# EasyEDA Pro project EasyEda.epro

# Schematic drv8833
Board Name: drv8833; Create Date: 2026-02-26; Page Name: P1; Project Name: motor driver; Schematic Name: drv8833; Update Date: 2026-03-20; Company: EasyEDA.com; Page Size: A4; Version: V1.0
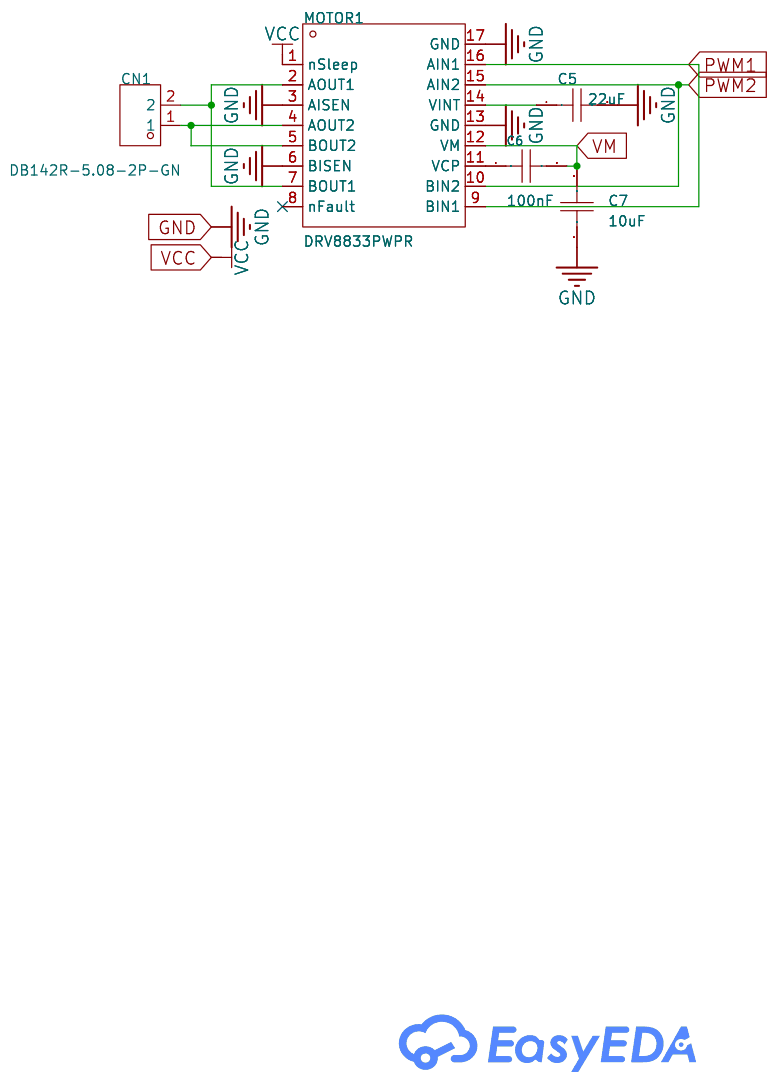
[diagram p0: schematic sheet]

## Parts
C5  22uF  [C0805]
C6  100nF  [C0402]
C7  10uF  [C0805]
CN1  DB142R-5.08-2P-GN  [CONN-TH_2P-P5.08_DIBO_DB142R-5.08-2P]
MOTOR1  DRV8833PWPR  [TSSOP-16_L5.0-W4.4-P0.65-LS6.4-BL-EP]

## Library data of the parts
C5 = CL21A226MAQNNNE: Capacitance:22uF Tolerance:±20% Tolerance:±20% Voltage Rating:25V Temperature Coefficient:X5R; LCSC Part Name: 22uF ±20% 25V; Supplier Part: C45783; Manufacturer: SAMSUNG(三星); Supplier Footprint: 0805; JLCPCB Part Class: Basic Part; Datasheet: https://item.szlcsc.com/datasheet/CL21A226MAQNNNE/46786.html; Supplier: LCSC; Tolerance: ±20%; Voltage Rating: 25V; Temperature Coefficient: X5R
C6 = CL05B104KO5NNNC: Capacitance:100nF Tolerance:±10% Tolerance:±10% Voltage Rating:16V Temperature Coefficient:X7R; LCSC Part Name: 100nF ±10% 16V; Supplier Part: C1525; Manufacturer: SAMSUNG(三星); Supplier Footprint: 0402; JLCPCB Part Class: Basic Part; Datasheet: https://item.szlcsc.com/datasheet/CL05B104KO5NNNC/1877.html; Supplier: LCSC; Tolerance: ±10%; Voltage Rating: 16V; Temperature Coefficient: X7R
C7 = CL21A106KAYNNNE_C15850: Capacitance:10uF Tolerance:±10% Tolerance:±10% Voltage Rating:25V Temperature Coefficient:X5R; LCSC Part Name: 10uF ±10% 25V; Supplier Part: C15850; Manufacturer: SAMSUNG(三星); Manufacturer Part: CL21A106KAYNNNE; Supplier Footprint: 0805; JLCPCB Part Class: Basic Part; Datasheet: https://item.szlcsc.com/datasheet/CL21A106KAYNNNE/16532.html; Supplier: LCSC; Tolerance: ±10%; Voltage Rating: 25V; Temperature Coefficient: X5R
CN1 = DB142R-5.08-2P-GN: Number of Positions or Pins:1x2P Pitch:5.08mm Color:Green Mounting Type:- Number of Pins:2P Number of PINs Per Row:2 Number of Rows:1 Current Rating:10A Voltage Rating (Max):300V Wire Gauge - AWG:14~24 Wire Gauge - mm2:1.5 Operating Temperature:-40℃~+105℃; LCSC Part Name: 1x2P 5.08mm 每排P数:2 排数:1; Supplier Part: C2898709; Manufacturer: DORABO(地博电气); Supplier Footprint: 弯插,P=5.08mm; Datasheet: https://item.szlcsc.com/datasheet/DB142R-5.08-2P-GN/3146288.html; Supplier: LCSC; Number of Positions or Pins: 1x2P; Pitch: 5.08mm; Color: Green; Number of Pins: 2P; Number of PINs Per Row: 2; Number of Rows: 1; Current Rating: 10A; Voltage Rating (Max): 300V; Wire Gauge - AWG: 14~24; Wire Gauge - mm2: 1.5; Operating Temperature: -40℃~+105℃
MOTOR1 = DRV8833PWPR: Technology:Yes Operating Temperature:-40℃~+85℃ Operating Temperature:-40℃~+85℃; LCSC Part Name: 1.5A 有刷直流电机驱动芯片 10.8V; Supplier Part: C50506; Manufacturer: TI(德州仪器); Supplier Footprint: TSSOP-16-EP; JLCPCB Part Class: Extended Part; Datasheet: https://www.ti.com/cn/lit/gpn/drv8833; Supplier: LCSC; Technology: Yes; Operating Temperature: -40℃~+85℃

## Nets
GND: C5.2 C7.1 MOTOR1.3(AISEN) MOTOR1.6(BISEN) MOTOR1.13(GND) MOTOR1.17(GND)
VCC: MOTOR1.1(nSleep)
PWM1: MOTOR1.9(BIN1) MOTOR1.16(AIN1)
PWM2: MOTOR1.10(BIN2) MOTOR1.15(AIN2)
VM: C6.2 C7.2 MOTOR1.12(VM)
$1N433: C5.1 MOTOR1.14(VINT)
$1N443: C6.1 MOTOR1.11(VCP)
$1N451: CN1.2 MOTOR1.2(AOUT1) MOTOR1.7(BOUT1)
$1N910: CN1.1 MOTOR1.4(AOUT2) MOTOR1.5(BOUT2)

Not connected (* = marked no-connect by the designer): MOTOR1 8(nFault)*

# Schematic MT6701
Board Name: MT6701; Create Date: 2026-02-26; Page Name: P1; Project Name: motor driver; Schematic Name: MT6701; Update Date: 2026-03-17; Company: EasyEDA.com; Page Size: A4; Version: V1.0
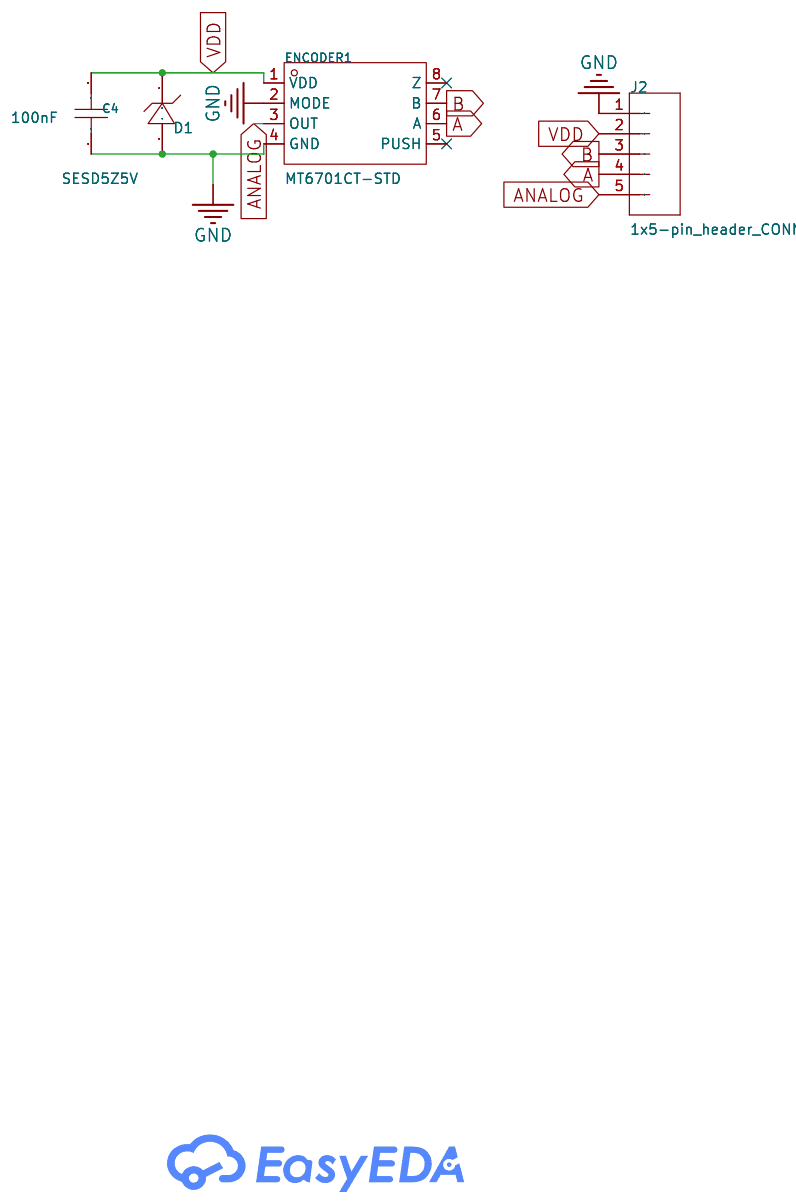
[diagram p1: schematic sheet]

## Parts
C4  100nF  [C0402]
D1  SESD5Z5V  [SOD-523_L1.2-W0.8-LS1.6-RD]
ENCODER1  MT6701CT-STD  [SOP-8_L4.9-W3.9-P1.27-LS6.0-BL]
J2  1x5-pin_header_CONN_05_NO_SILK  [1X05_NO_SILK-CUSTOM]

## Library data of the parts
C4 = CC0402KRX7R7BB104: Capacitance: Tolerance:±10% Tolerance:±10% Voltage Rated: Temperature Coefficient:; LCSC Part Name: 100nF ±10% 16V; Supplier Part: C60474; Manufacturer: YAGEO(国巨); Supplier Footprint: 0402; JLCPCB Part Class: Extended Part; Datasheet: https://atta.szlcsc.com/upload/public/pdf/source/20211223/9278FD768280B81DDBEF48FA36411A03.pdf; Supplier: LCSC; Tolerance: ±10%
D1 = SESD5Z5V: Reverse Stand-Off Voltage (Vrwm):5V Clamping Voltage:6V Peak Pulse Power Dissipation (Ppp):200W@8/20us Voltage - Breakdown:7.1V Reverse Leakage Current (Ir):1uA Operating Temperature:-40℃~+125℃ Operating Temperature:-40℃~+125℃ level of protection:IEC 6100; LCSC Part Name: TVS 5V截止; Supplier Part: C19631222; Manufacturer: SINO-IC(光宇睿芯); Supplier Footprint: SOD-523; JLCPCB Part Class: Extended Part; Datasheet: https://item.szlcsc.com/datasheet/SESD5Z5V/20924295.html; Supplier: LCSC; Reverse Stand-Off Voltage (Vrwm): 5V; Clamping Voltage: 6V; Peak Pulse Power Dissipation (Ppp): 200W@8/20us; Voltage - Breakdown: 7.1V; Reverse Leakage Current (Ir): 1uA; Operating Temperature: -40℃~+125℃; level of protection: IEC 61000-4-4；IEC 61000-4-2; Type: TVS; Junction Capacitance: 30pF
ENCODER1 = MT6701CT-STD: LCSC Part Name: 霍尔在线编程角度位置传感器; Supplier Part: C2856764; Manufacturer: MagnTek(麦歌恩); Supplier Footprint: SOP-8; Datasheet: https://item.szlcsc.com/datasheet/MT6701CT-STD/3056853.html; Supplier: LCSC
J2 = 1x5-pin_header_CONN_05_NO_SILK

## Nets
GND: C4.1 D1.2(A) ENCODER1.2(MODE) ENCODER1.4(GND) J2.1
VDD: C4.2 D1.1(C) ENCODER1.1(VDD) J2.2
A: ENCODER1.6(A) J2.4
ANALOG: ENCODER1.3(OUT) J2.5
B: ENCODER1.7(B) J2.3

Not connected (* = marked no-connect by the designer): ENCODER1 5(PUSH)* 8(Z)*

# Schematic Schematic1

## Sheets
1 P1: Board Name: Board1; Create Date: 2026-02-24; Page Name: P1; Project Name: motor driver; Schematic Name: Schematic1; Update Date: 2026-03-19; Company: EasyEDA.com; Page Size: A4; Version: V1.0
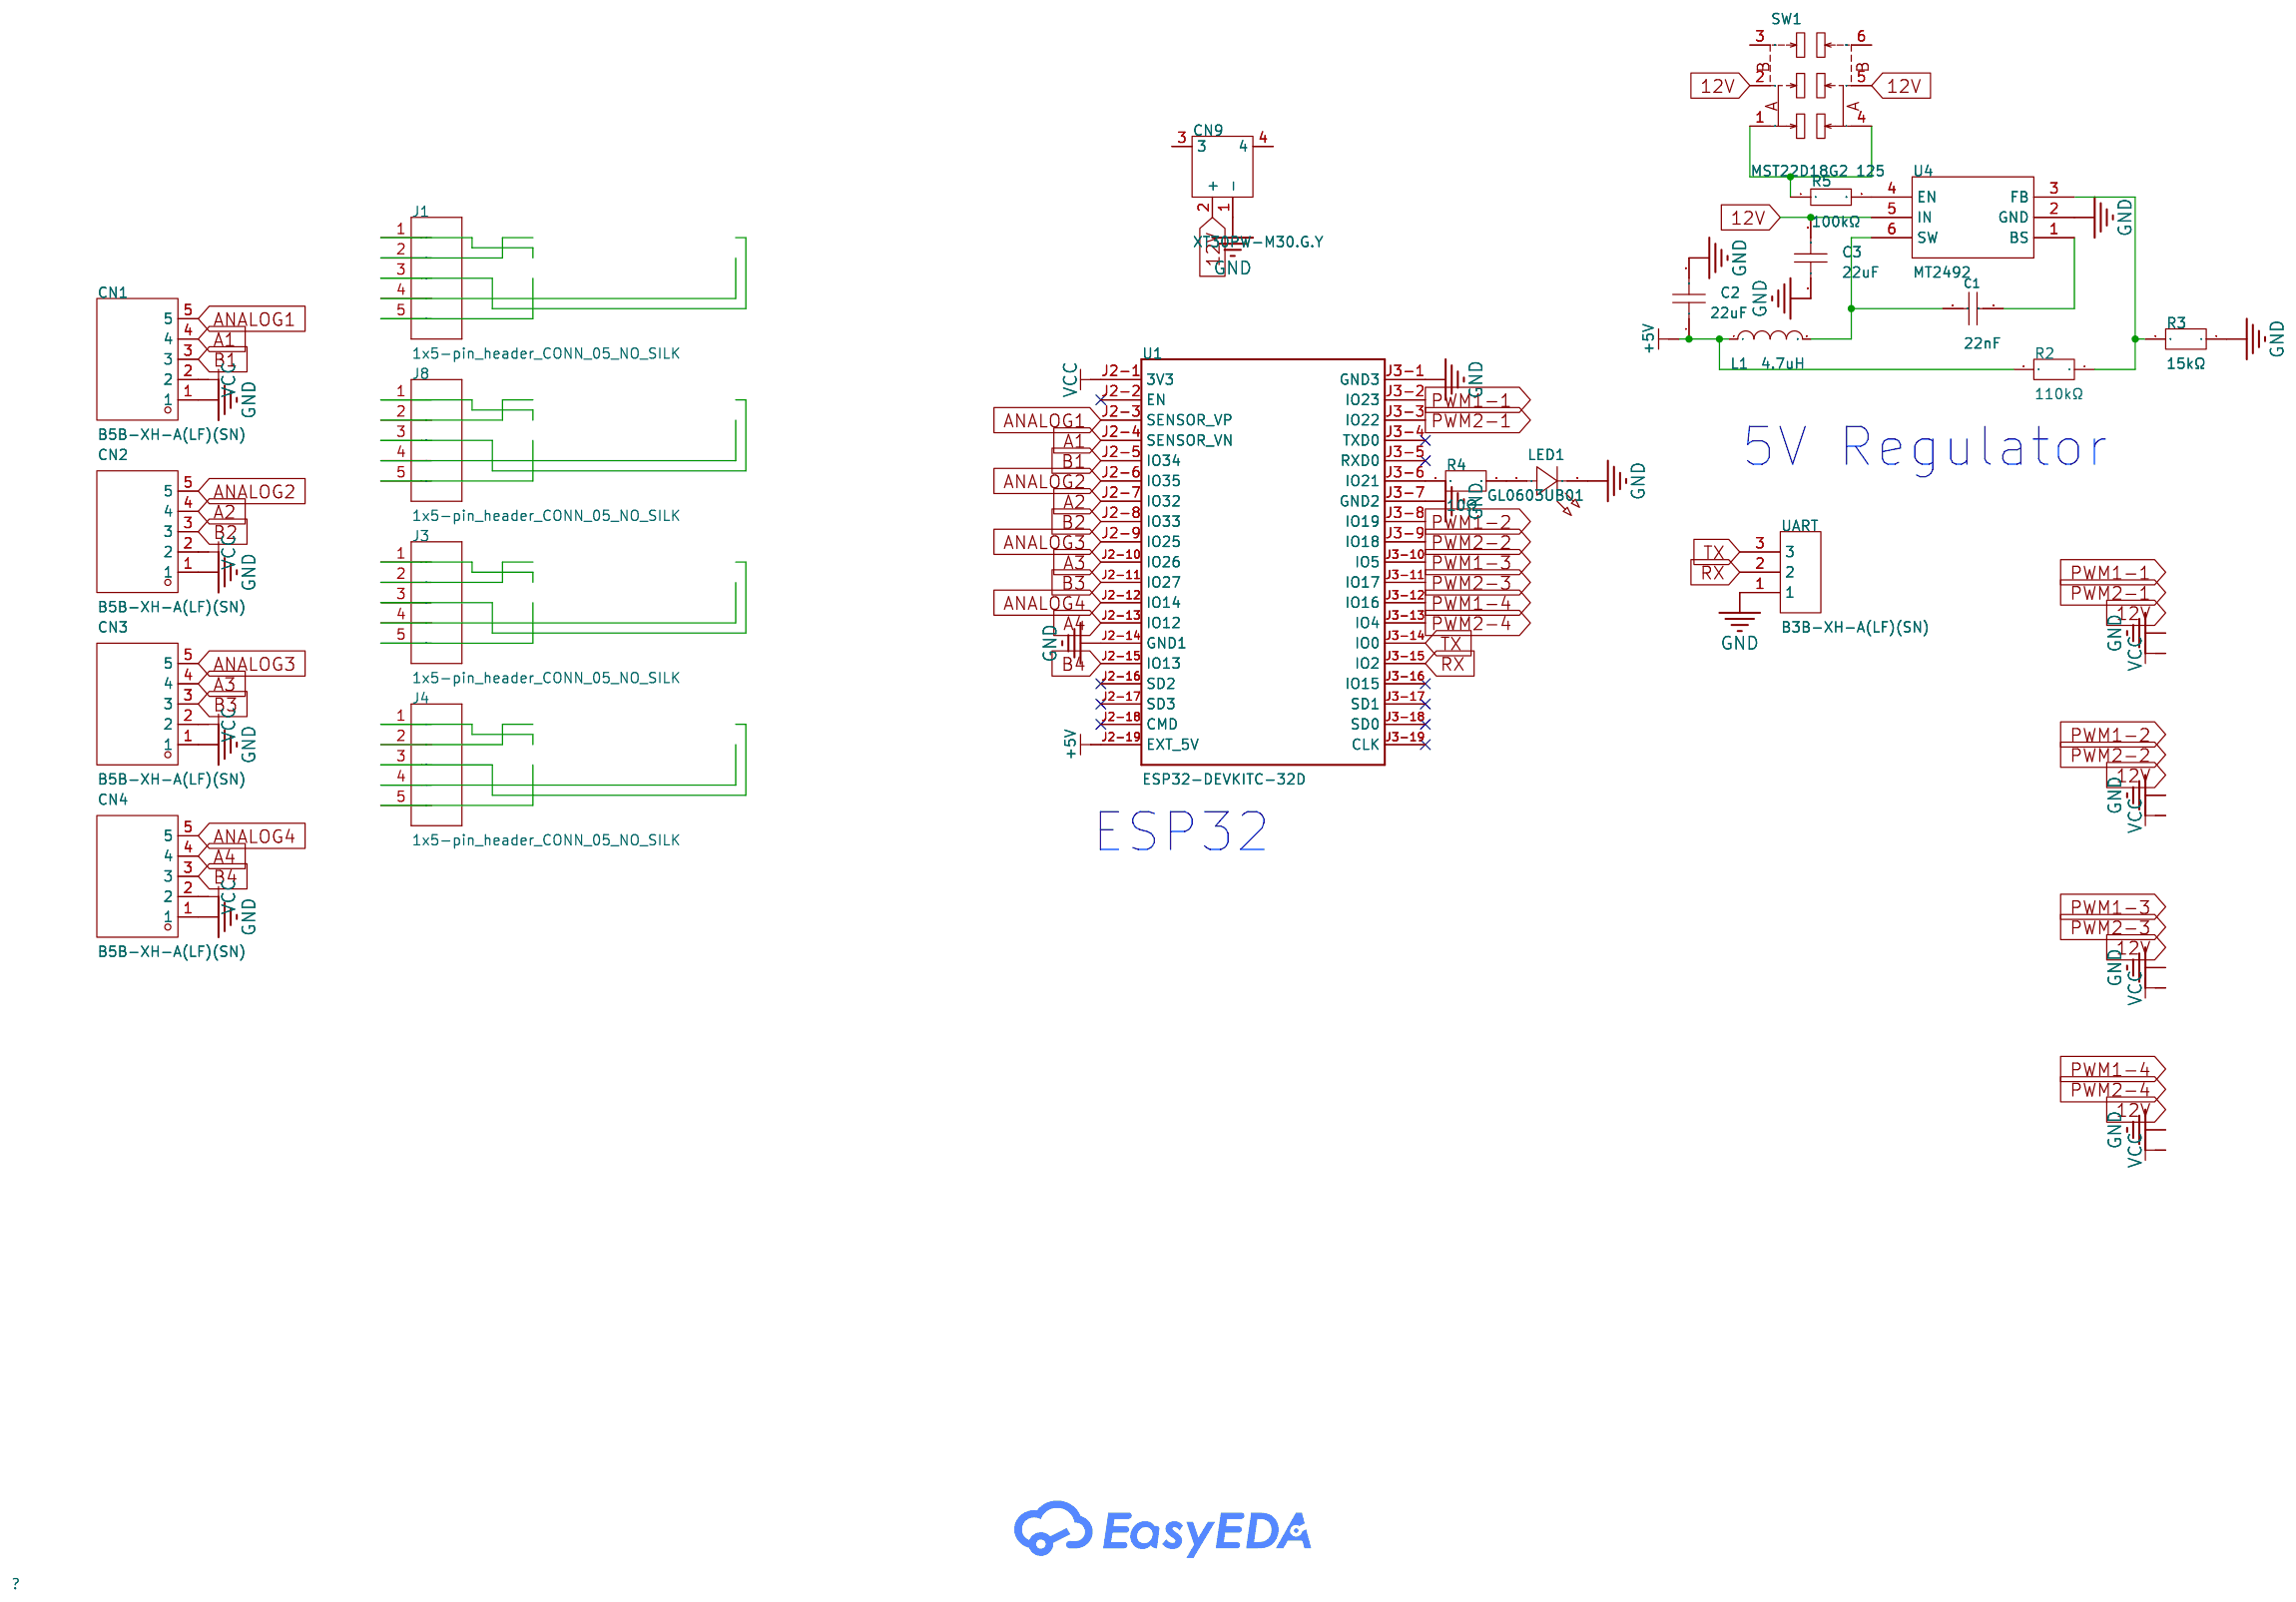
[diagram p2: P1]
2 P2: Create Date: 2026-02-25; Page Name: P2; Update Date: 2026-02-24
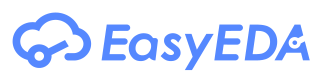
[diagram p3: P2]

## Parts
C1  22nF  [C0603]
C2  22uF  [C0805]
C3  22uF  [C0805]
CN1  B5B-XH-A(LF)(SN)  [CONN-TH_B5B-XH-A-LF-SN]
CN2  B5B-XH-A(LF)(SN)  [CONN-TH_B5B-XH-A-LF-SN]
CN3  B5B-XH-A(LF)(SN)  [CONN-TH_B5B-XH-A-LF-SN]
CN4  B5B-XH-A(LF)(SN)  [CONN-TH_B5B-XH-A-LF-SN]
CN9  XT30PW-M30.G.Y  [CONN-TH_XT30PW-M]
ENCODE1  -
ENCODE2  -
ENCODE3  -
ENCODE4  -
J1  1x5-pin_header_CONN_05_NO_SILK  [1X05_NO_SILK-CUSTOM]
J3  1x5-pin_header_CONN_05_NO_SILK  [1X05_NO_SILK-CUSTOM]
J4  1x5-pin_header_CONN_05_NO_SILK  [1X05_NO_SILK-CUSTOM]
J8  1x5-pin_header_CONN_05_NO_SILK  [1X05_NO_SILK-CUSTOM]
L1  4.7uH  [IND-SMD_L3.0-W3.0-1]
LED1  GL0603UB01  [LED0603-RD_BLUE]
MOTORDRIVER1  -
MOTORDRIVER2  -
MOTORDRIVER3  -
MOTORDRIVER4  -
R2  110kΩ  [R0603]
R3  15kΩ  [R0603]
R4  10Ω  [R1206]
R5  100kΩ  [R0402]
SW1  MST22D18G2 125  [SW-SMD_MST22D18G2]
U1  ESP32-DEVKITC-32D  [MODULE_ESP32-DEVKITC-32D]
U4  MT2492  [SOT-23-6_L2.9-W1.6-P0.95-LS2.8-BL_3]
UART  B3B-XH-A(LF)(SN)  [CONN-TH_3P-P2.50_A2501WV2-3P]

## Library data of the parts
C1 = CL10B223KB8NNNC: Capacitance:22nF Tolerance:±10% Tolerance:±10% Voltage Rating:50V Temperature Coefficient:X7R; LCSC Part Name: 22nF ±10% 50V; Supplier Part: C21122; Manufacturer: SAMSUNG(三星); Supplier Footprint: 0603; Datasheet: https://item.szlcsc.com/datasheet/CL10B223KB8NNNC/21834.html; Supplier: LCSC; Tolerance: ±10%; Voltage Rating: 50V; Temperature Coefficient: X7R
C2 C3 = CL21A226MQQNNNE: Capacitance:22uF Tolerance:±20% Tolerance:±20% Voltage Rating:6.3V Temperature Coefficient:X5R; LCSC Part Name: 22uF ±20% 6.3V; Supplier Part: C5674; Manufacturer: SAMSUNG(三星); Supplier Footprint: 0805; JLCPCB Part Class: Extended Part; Datasheet: https://item.szlcsc.com/datasheet/CL21A226MQQNNNE/6133.html; Supplier: LCSC; Tolerance: ±20%; Voltage Rating: 6.3V; Temperature Coefficient: X5R
CN1-CN4 = B5B-XH-A(LF)(SN): Pins Structure:1x5P Pitch:2.5mm Mounting Type:Through Hole Reference Series:XH Number of Pins:5P Number of Rows:1 Number of PINs Per Row:5 Row Spacing:- Current Rating:3A Contact Material:Brass Contact Plating:Tin Operating Temperature:-25℃~+85℃ Operating; LCSC Part Name: 1x5P 间距:2.5mm 直插 系列:XH; Supplier Part: C157991; Manufacturer: JST; Supplier Footprint: 插件,P=2.5mm; JLCPCB Part Class: Extended Part; Datasheet: https://item.szlcsc.com/datasheet/B5B-XH-A(LF)(SN)/169339.html; Supplier: LCSC; Pins Structure: 1x5P; Pitch: 2.5mm; Mounting Type: Through Hole; Reference Series: XH; Number of Pins: 5P; Number of Rows: 1; Number of PINs Per Row: 5; Current Rating: 3A; Contact Material: Brass; Contact Plating: Tin; Operating Temperature: -25℃~+85℃; Voltage Rating: 250V; Plastic Material: PA66; Flame Retardant Rating: UL94V-0; Supplementary Features: K Pin; Color: White; Z-Height of the Board: 7mm; X-Length of Bottom Edge on Board (Spacing Line): 14.9mm; Y-Width of Bottom Edge on Board: 5.75mm
CN9 = XT30PW-M30.G.Y: Rated current:15A Rated voltage: Connector type:Model aircraft plug Wire gauge: contact resistance: Size/Specification: interface form:Male; LCSC Part Name: AMASS(艾迈斯)航模插头 卧式弯脚 XT30PW-M公头; Supplier Part: C431092; Manufacturer: AMASS(艾迈斯); Datasheet: https://item.szlcsc.com/datasheet/XT30PW-M30.G.Y/426930.html; Supplier: LCSC; Rated current: 15A; Connector type: Model aircraft plug; interface form: Male
J1 J3 J4 J8 = 1x5-pin_header_CONN_05_NO_SILK
L1 = ANR3015T4R7M: Inductance:4.7uH Tolerance:±20% Tolerance:±20% Current Rating:1.3A Current - Saturation(Isat):1.4A Type:Magnetic Shielded Inductor; LCSC Part Name: 4.7uH ±20% 1.4A 3x3x1.5mm; Supplier Part: C7427089; Manufacturer: APV(爱普微); Supplier Footprint: SMD,3x3mm; JLCPCB Part Class: Extended Part; Datasheet: https://item.szlcsc.com/datasheet/ANR3015T4R7M/8418961.html; Supplier: LCSC; Tolerance: ±20%; Current Rating: 1.3A; Current - Saturation(Isat): 1.4A; Type: Magnetic Shielded Inductor
LED1 = GL0603UB01: Illumination Color:Blue Voltage - Forward(Vf):2.9V Voltage - Forward(Vf):2.9V Forward Current:20mA Wavelength - Dominant:460nm~469nm Wavelength - Dominant:460nm~469nm Diode Configuration:Discrete Diode Lens Color:Water Clear Luminous Intensity:72mcd Lumin; LCSC Part Name: 0603 蓝灯 高亮; Supplier Part: C51933294; Manufacturer: Guiguang light(桂光光电); Supplier Footprint: 0603; JLCPCB Part Class: Extended Part; Datasheet: https://item.szlcsc.com/datasheet/GL0603UB01/54645990.html; Supplier: LCSC; Illumination Color: Blue; Voltage - Forward(Vf): 2.9V; Forward Current: 20mA; Wavelength - Dominant: 460nm~469nm; Diode Configuration: Discrete Diode; Lens Color: Water Clear; Luminous Intensity: 72mcd; Viewing Angle: 120°; Mounting Style: Top-mount; Operating Temperature: -40℃~+85℃
R2 = FRC0603F1103TS: Type:Thick Film Resistor Resistance:110kΩ Tolerance:±1% Tolerance:±1% Power(Watts):100mW Voltage-Supply(Max):75V Temperature Coefficient:±100ppm/℃ Temperature Coefficient:±100ppm/℃ Operating Temperature:-55℃~+155℃ Operating Temperature:-55℃~+155℃; LCSC Part Name: 110kΩ ±1% 100mW 厚膜电阻; Supplier Part: C2906984; Manufacturer: FOJAN(富捷); Supplier Footprint: 0603; Supplier: LCSC; Type: Thick Film Resistor; Tolerance: ±1%; Power(Watts): 100mW; Voltage-Supply(Max): 75V; Temperature Coefficient: ±100ppm/℃; Operating Temperature: -55℃~+155℃
R3 = FRC0603F1502TS: Type:Thick Film Resistor Resistance:15kΩ Tolerance:±1% Tolerance:±1% Power(Watts):100mW Voltage-Supply(Max):75V Temperature Coefficient:±100ppm/℃ Temperature Coefficient:±100ppm/℃ Operating Temperature:-55℃~+155℃ Operating Temperature:-55℃~+155℃; LCSC Part Name: 15kΩ ±1% 100mW 厚膜电阻; Supplier Part: C2906995; Manufacturer: FOJAN(富捷); Supplier Footprint: 0603; JLCPCB Part Class: Extended Part; Supplier: LCSC; Type: Thick Film Resistor; Tolerance: ±1%; Power(Watts): 100mW; Voltage-Supply(Max): 75V; Temperature Coefficient: ±100ppm/℃; Operating Temperature: -55℃~+155℃
R4 = FRC1206F10R0TS: Type:Thick Film Resistor Resistance:10Ω Tolerance:±1% Tolerance:±1% Power(Watts):250mW Voltage-Supply(Max):200V Temperature Coefficient:±200ppm/℃ Temperature Coefficient:±200ppm/℃ Operating Temperature:-55℃~+155℃ Operating Temperature:-55℃~+155℃; LCSC Part Name: 10Ω ±1% 250mW 厚膜电阻; Supplier Part: C2907371; Manufacturer: FOJAN(富捷); Supplier Footprint: 1206; Supplier: LCSC; Type: Thick Film Resistor; Tolerance: ±1%; Power(Watts): 250mW; Voltage-Supply(Max): 200V; Temperature Coefficient: ±200ppm/℃; Operating Temperature: -55℃~+155℃
R5 = RC0402FR-07100KL: Type:Thick Film Resistor Resistance:100kΩ Tolerance:±1% Tolerance:±1% Power(Watts):62.5mW Voltage-Supply(Max):50V Temperature Coefficient:±100ppm/℃ Temperature Coefficient:±100ppm/℃ Operating Temperature:-55℃~+155℃ Operating Temperature:-55℃~+155℃; LCSC Part Name: 厚膜电阻 100kΩ ±1% 62.5mW; Supplier Part: C60491; Manufacturer: YAGEO(国巨); Supplier Footprint: 0402; JLCPCB Part Class: Extended Part; Datasheet: https://item.szlcsc.com/datasheet/RC0402FR-07100KL/61543.html; Supplier: LCSC; Type: Thick Film Resistor; Tolerance: ±1%; Power(Watts): 62.5mW; Voltage-Supply(Max): 50V; Temperature Coefficient: ±100ppm/℃; Operating Temperature: -55℃~+155℃
SW1 = MST22D18G2 125: Circuit:DPDT Termination Style:Gull Wing Mounting Type:Surface Mount,Vertical Actuator Color:Black Current Rating:100mA Voltage Rating:12V Life:10,000 cycles Operating Temperature:-25℃~+70℃ Operating Temperature:-25℃~+70℃; LCSC Part Name: MST-22D18G2脚距6.9; Supplier Part: C2906280; Manufacturer: SHOU HAN(首韩); Supplier Footprint: SMD; JLCPCB Part Class: Extended Part; Datasheet: https://item.szlcsc.com/datasheet/MST22D18G2%2520125/3178990.html; Supplier: LCSC; Circuit: DPDT; Termination Style: Gull Wing; Mounting Type: Surface Mount,Vertical; Actuator Color: Black; Current Rating: 100mA; Voltage Rating: 12V; Life: 10,000 cycles; Operating Temperature: -25℃~+70℃
U1 = ESP32-DEVKITC-32D
U4 = MT2492: Function:Buck Voltage - Supply:4.5V~16V Voltage - Supply:4.5V~16V Output Voltage:- Output Voltage:- Output Current:2A Frequency - Switching:600kHz Frequency - Switching:600kHz Operating Temperature:-40℃~+85℃@(TA) Operating Temperature:-40℃~+85℃@(TA) Synch; LCSC Part Name: 2A高效同步降压转换器; Supplier Part: C89358; Manufacturer: 西安航天民芯; Supplier Footprint: SOT-23-6; JLCPCB Part Class: Extended Part; Datasheet: https://item.szlcsc.com/datasheet/MT2492/90538.html; Supplier: LCSC; Function: Buck; Voltage - Supply: 4.5V~16V; Output Current: 2A; Frequency - Switching: 600kHz; Operating Temperature: -40℃~+85℃@(TA); Synchronous Rectifier: Yes; Number of Outputs: 1; Topology: Buck; Switch tube (built-in/external): Built-in; Output Type: Adjustable
UART = B3B-XH-A(LF)(SN): Pins Structure:1x3P Pitch:2.5mm Mounting Type:Through Hole Reference Series:XH Number of Pins:3P Number of Rows:1 Number of PINs Per Row:3 Row Spacing:- Current Rating:3A Contact Material:Brass Contact Plating:Tin Operating Temperature:-25℃~+85℃ Operating; LCSC Part Name: 1x3P 间距:2.5mm 直插 系列:XH; Supplier Part: C144394; Manufacturer: JST; Supplier Footprint: 插件,P=2.5mm; JLCPCB Part Class: Extended Part; Datasheet: https://item.szlcsc.com/datasheet/B3B-XH-A(LF)(SN)/155726.html; Supplier: LCSC; Pins Structure: 1x3P; Pitch: 2.5mm; Mounting Type: Through Hole; Reference Series: XH; Number of Pins: 3P; Number of Rows: 1; Number of PINs Per Row: 3; Current Rating: 3A; Contact Material: Brass; Contact Plating: Tin; Operating Temperature: -25℃~+85℃; Voltage Rating: 250V; Plastic Material: PA66; Flame Retardant Rating: UL94V-0; Supplementary Features: K Pin; Color: White; Z-Height of the Board: 7mm; X-Length of Bottom Edge on Board (Spacing Line): 9.9mm; Y-Width of Bottom Edge on Board: 5.75mm

## Nets
+5V: C2.1 L1.1 R2.2 U1.J2-19(EXT_5V)
GND: C2.2 C3.1 C3.2 CN1.1 CN1.2 CN2.1 CN2.2 CN3.1 CN3.2 CN4.1 CN4.2 CN9.1(-) CN9.2(+) LED1.1(K) MOTORDRIVER1.(VCC) MOTORDRIVER2.(VCC) MOTORDRIVER3.(VCC) MOTORDRIVER4.(VCC) R3.1 SW1.2 SW1.5 U1.J2-1(3V3) U1.J2-14(GND1) U1.J3-1(GND3) U1.J3-2(IO23) U1.J3-3(IO22) U1.J3-7(GND2) U1.J3-8(IO19) U1.J3-9(IO18) U1.J3-10(IO5) U1.J3-11(IO17) U1.J3-12(IO16) U1.J3-13(IO4) U4.2(GND) U4.5(IN) UART.1
A1: CN1.4 U1.J2-4(SENSOR_VN)
A2: CN2.4 U1.J2-7(IO32)
A3: CN3.4 U1.J2-10(IO26)
A4: CN4.4 U1.J2-13(IO12)
ANALOG1: CN1.5 U1.J2-3(SENSOR_VP)
ANALOG2: CN2.5 U1.J2-6(IO35)
ANALOG3: CN3.5 U1.J2-9(IO25)
ANALOG4: CN4.5 U1.J2-12(IO14)
B1: CN1.3 U1.J2-5(IO34)
B2: CN2.3 U1.J2-8(IO33)
B3: CN3.3 U1.J2-11(IO27)
B4: CN4.3 U1.J2-15(IO13)
RX: U1.J3-15(IO2) UART.2
TX: U1.J3-14(IO0) UART.3
$1N1716: C1.2 U4.1(BS)
$1N1826: R2.1 R3.2 U4.3(FB)
$1N2230: C1.1 L1.2 U4.6(SW)
$1N8555: R4.1 U1.J3-6(IO21)
$1N12055: R5.1 SW1.1 SW1.4
$1N12057: R5.2 U4.4(EN)
Net-(ENCODE1-): ENCODE1.(A) J1.1 J1.2 J1.3 J1.4 J1.5
Net-(ENCODE2-): ENCODE2.(A) J8.1 J8.2 J8.3 J8.4 J8.5
Net-(ENCODE3-): ENCODE3.(A) J3.1 J3.2 J3.3 J3.4 J3.5
Net-(ENCODE4-): ENCODE4.(A) J4.1 J4.2 J4.3 J4.4 J4.5
Net-(LED1-2): LED1.2(A) R4.2

Not connected (* = marked no-connect by the designer): CN9 3 4; SW1 3 6; U1 J2-2(EN)* J2-16(SD2)* J2-17(SD3)* J2-18(CMD)* J3-4(TXD0)* J3-5(RXD0)* J3-16(IO15)* J3-17(SD1)* J3-18(SD0)* J3-19(CLK)*

## Notes on the sheets
sheet 1
- 5V Regulator
- ESP32

# Board drv8833
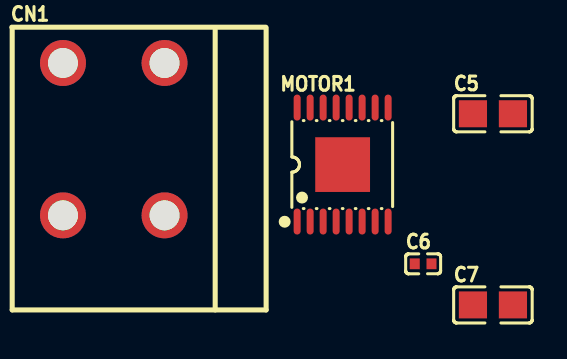
[diagram p4: board, top side]
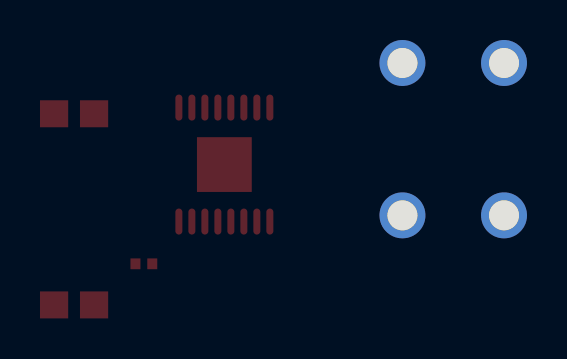
[diagram p5: board, bottom side, seen from below]

No outline. copper layers: Top Layer, Bottom Layer. Coordinates in mm from the lowest, leftmost part position.
Stack: Top Layer 0.035mm / Dielectric1 1.51mm FR4 er 4.5 / Bottom Layer 0.035mm

## Design rules (mm)
template: JLCPCB Capability(Two Layers Board)
spacing copperThickness1oz (default): track to track 0.102, other pairs 0.152 to 0.3
spacing copperThickness2oz: track to track 0.203, other pairs 0.152 to 0.3
track width copperThickness1oz (default): min 0.127, default 0.254, max 2.54
track width copperThickness2oz: min 0.203, default 0.254, max 2.54
differential pair differentialPair (default): width min 0.127, default 0.254, max 2.54; gap min 0.152, default 0.152
via viaSize (default): diameter min 0.5, default 0.61, max 10; hole min 0.3, default 0.305, max 6.3

## Placement (name value [footprint] x y rotation side)
C5  22uF  [C0805]  18.96 9.56 0 top
C6  100nF  [C0402]  15.47 2.06 0 top
C7  10uF  [C0805]  18.96 0 0 top
CN1  DB142R-5.08-2P-GN  [CONN-TH_2P-P5.08_DIBO_DB142R-5.08-2P]  0 8.29 0 top
MOTOR1  DRV8833PWPR  [TSSOP-16_L5.0-W4.4-P0.65-LS6.4-BL-EP]  11.45 7.02 0 top

## Footprints (pads in the part's own frame, mm; a bottom-side part is the same pattern mirrored in y, then rotated)
C0402
  rect 0.5x0.54 smd: 1(-0.42,0) 2(0.42,0)
C0805
  rect 1.41x1.35 smd: 1(-1,0) 2(1,0)
CONN-TH_2P-P5.08_DIBO_DB142R-5.08-2P
  round 2.3 hole 1.5: 1(-2.54,3.81) 1(-2.54,-3.81) 2(2.54,3.81) 2(2.54,-3.81)
TSSOP-16_L5.0-W4.4-P0.65-LS6.4-BL-EP
  oval 0.35x1.3 smd: 1(-2.275,-2.85) 2(-1.625,-2.85) 3(-0.975,-2.85) 4(-0.325,-2.85) 5(0.325,-2.85) 6(0.975,-2.85) 7(1.625,-2.85) 8(2.275,-2.85) 9(2.275,2.85) 10(1.625,2.85) 11(0.975,2.85) 12(0.325,2.85) 13(-0.325,2.85) 14(-0.975,2.85) 15(-1.625,2.85) 16(-2.275,2.85)
  rect 2.74x2.74 smd: 17(0,0)

## Nets
As in the schematic.

Pads without a net: MOTOR1 8

# Board MT6701
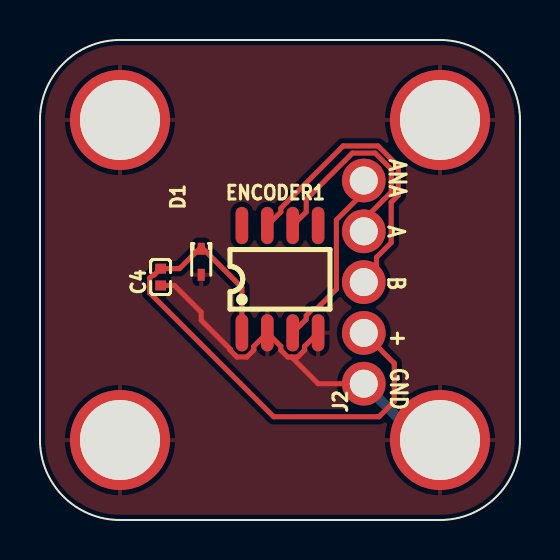
[diagram p6: board, top side]
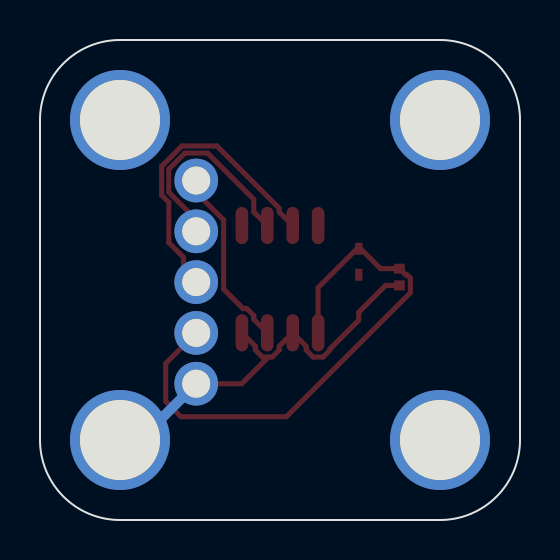
[diagram p7: board, bottom side, seen from below]

Outline 24 x 24 mm; copper layers: Top Layer, Bottom Layer. Coordinates in mm from the lower left corner of the outline.
Outline path: 0,20 0,4 arc(1.17,1.17) 4,0 20,0 arc(22.83,1.17) 24,4 24,20 arc(22.83,22.83) 20,24 4,24 arc(1.17,22.83) 0,20
Stack: Top Layer 0.035mm / Dielectric1 1.51mm FR4 er 4.5 / Bottom Layer 0.035mm

## Design rules (mm)
template: JLCPCB Capability(Two Layers Board)
spacing copperThickness1oz (default): track to track 0.102, other pairs 0.152 to 0.3
spacing copperThickness2oz: track to track 0.203, other pairs 0.152 to 0.3
track width copperThickness1oz (default): min 0.127, default 0.254, max 2.54
track width copperThickness2oz: min 0.203, default 0.254, max 2.54
differential pair differentialPair (default): width min 0.127, default 0.254, max 2.54; gap min 0.152, default 0.152
via viaSize (default): diameter min 0.5, default 0.61, max 10; hole min 0.3, default 0.305, max 6.3

## Placement (name value [footprint] x y rotation side)
C4  100nF  [C0402]  6.03 12.15 90 top
D1  SESD5Z5V  [SOD-523_L1.2-W0.8-LS1.6-RD]  8.06 12.91 270 top
ENCODER1  MT6701CT-STD  [SOP-8_L4.9-W3.9-P1.27-LS6.0-BL]  12 12.04 0 top
J2  1x5-pin_header_CONN_05_NO_SILK  [1X05_NO_SILK-CUSTOM]  16.19 6.81 90 top
NOREF  -  [Pad_e6]  20 4 0 top
NOREF#2  -  [Pad_e7]  20 20 0 top
NOREF#3  -  [Pad_e5]  4 4 0 top
NOREF#4  -  [Pad_e1]  4 20 0 top

## Footprints (pads in the part's own frame, mm; a bottom-side part is the same pattern mirrored in y, then rotated)
1X05_NO_SILK-CUSTOM
  round 2.184 hole 1.4: 1(0,0) 2(2.54,0) 3(5.08,0) 4(7.62,0) 5(10.16,0)
C0402
  rect 0.5x0.54 smd: 1(-0.42,0) 2(0.42,0)
Pad_e1
  round 5 hole 4: 1(0,0)
Pad_e5
  round 5 hole 4: 1(0,0)
Pad_e6
  round 5 hole 4: 1(0,0)
Pad_e7
  round 5 hole 4: 1(0,0)
SOD-523_L1.2-W0.8-LS1.6-RD
  rect 0.6x0.36 smd: 1(-0.65,0) 2(0.65,0)
SOP-8_L4.9-W3.9-P1.27-LS6.0-BL
  oval 0.63x1.865 smd: 1(-1.905,-2.683) 2(-0.635,-2.683) 3(0.635,-2.683) 4(1.905,-2.683) 5(1.905,2.683) 6(0.635,2.683) 7(-0.635,2.683) 8(-1.905,2.683)

## Nets
As in the schematic, except:
GND: C4.1 D1.2 ENCODER1.2 ENCODER1.4 J2.1 NOREF.1 NOREF#2.1 NOREF#3.1 NOREF#4.1

Pads without a net: ENCODER1 5 8

## Routing (per net, layer and track width the routed paths; a pad name or vN(x,y) marks a point on that pad's centre or on a via; arc(x,y) is an arc through that point)
GND: length 20.6
  Top Layer w0.254: J2.1 13.91,6.81 12.58,8.15 ; ENCODER1.4 13.23,8.68 13.23,8.5 12.88,8.15 12.58,8.15 ; 12.58,8.15 12.39,8.15 12.04,8.5 12.04,8.68 ENCODER1.2 10.69,8.68 10.69,8.5 10.34,8.15 9.85,8.15 9.5,8.5 9.5,8.55 8.06,9.99 8.06,10.39 6.72,11.73 C4.1
  Bottom Layer w0.508: NOREF.1 19,4 J2.1
VDD: length 28.3
  Top Layer w0.254: J2.2 17.71,7.83 17.71,5.93 16.95,5.16 11.68,5.16 5.48,11.36 5.48,12.09 5.64,12.26 5.72,12.26 C4.2 6.97,12.57 8.06,13.66 10.09,11.62 ENCODER1.1
A: length 10.8
  Top Layer w0.254: J2.4 16.19,15.02 17.56,16.39 17.56,17.54 16.76,18.35 15.62,18.35 13.31,16.04 13.31,15.4 ENCODER1.6
ANALOG: length 9.2
  Top Layer w0.254: ENCODER1.3 13.31,10.04 13.31,10.22 13.66,10.57 13.85,10.57 14.82,11.54 14.82,15 16.19,16.37 J2.5
B: length 15.2
  Top Layer w0.254: J2.3 16.82,12.53 16.82,13.13 17.56,13.87 17.56,15.88 17.92,16.24 17.92,17.69 16.9,18.7 15.15,18.7 12.04,15.59 12.04,15.4 ENCODER1.7

## Copper pours and planes (outline as drawn; the poured copper is in the pictures)
GND on Top Layer: -4.26,26.25 28.51,26.25 28.51,-2.96 -4.26,-2.96

## Text on the board
Top Silkscreen Layer: A | B | ANA | + | GND

# Board PCB1
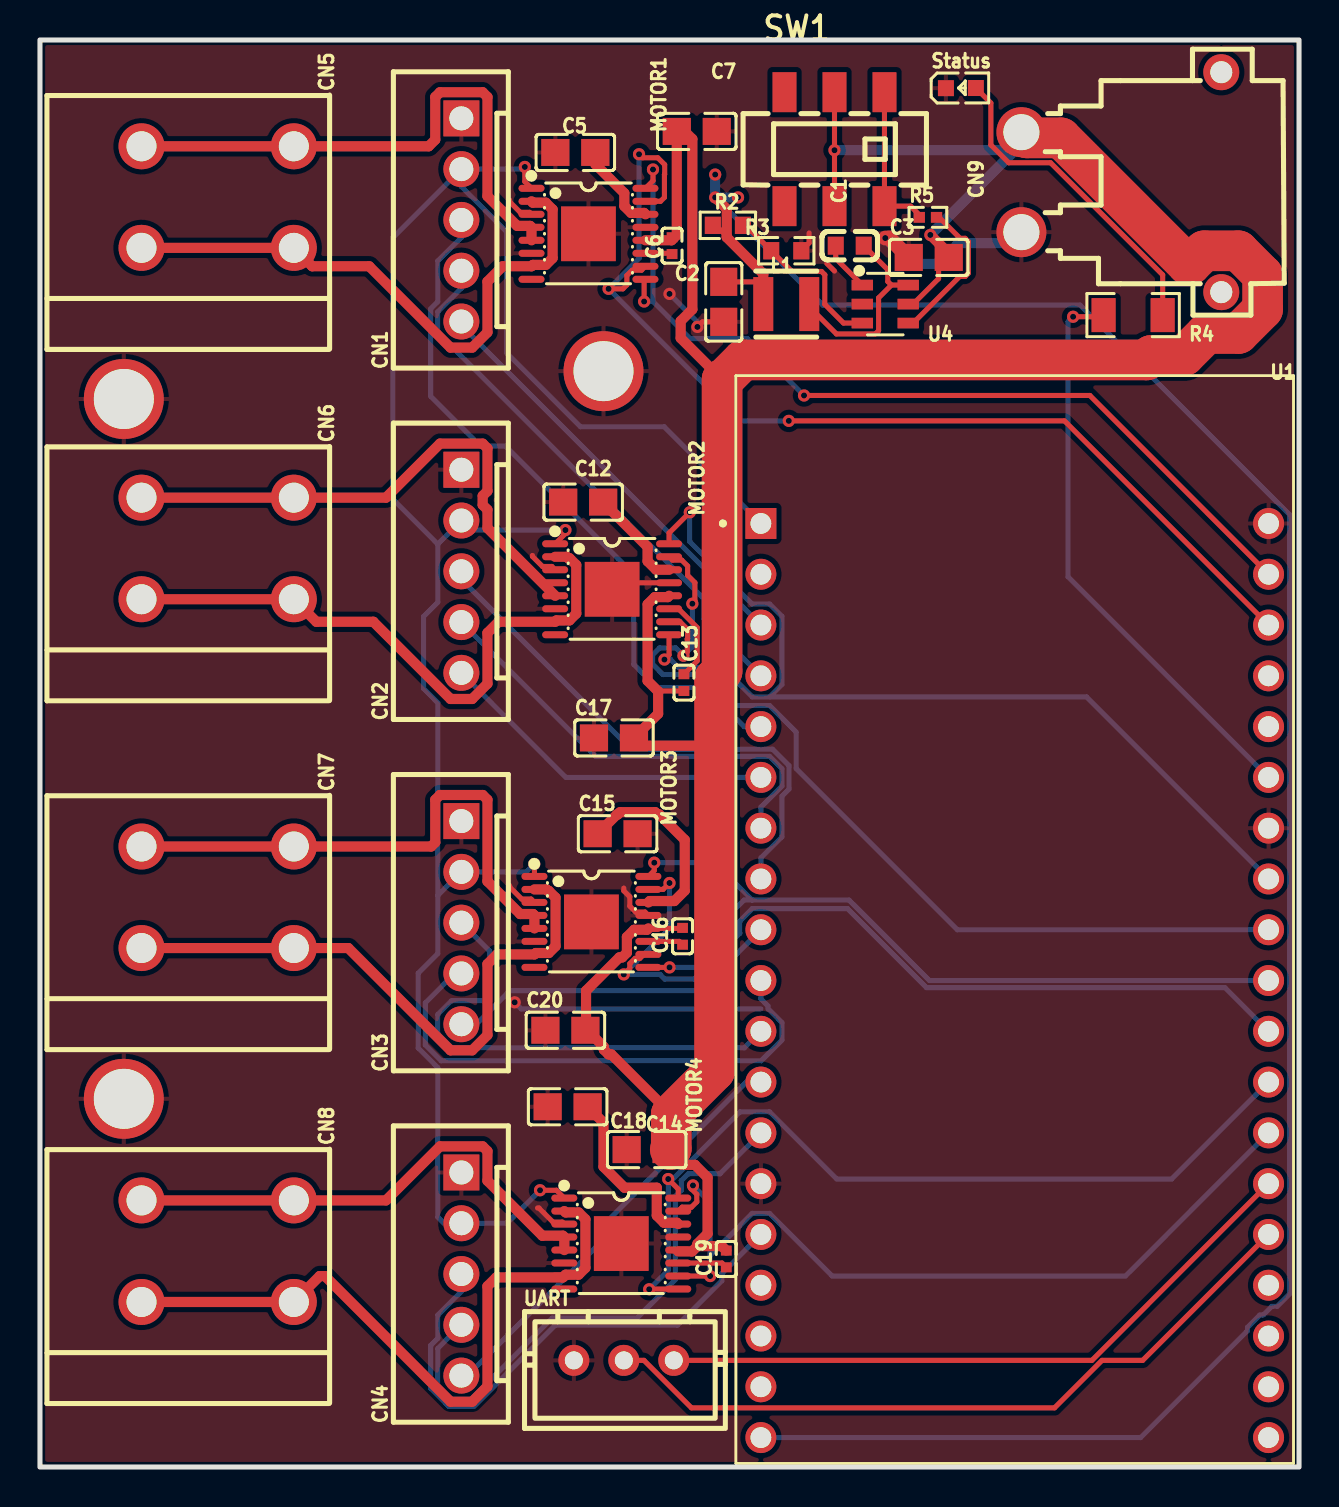
[diagram p8: board, top side]
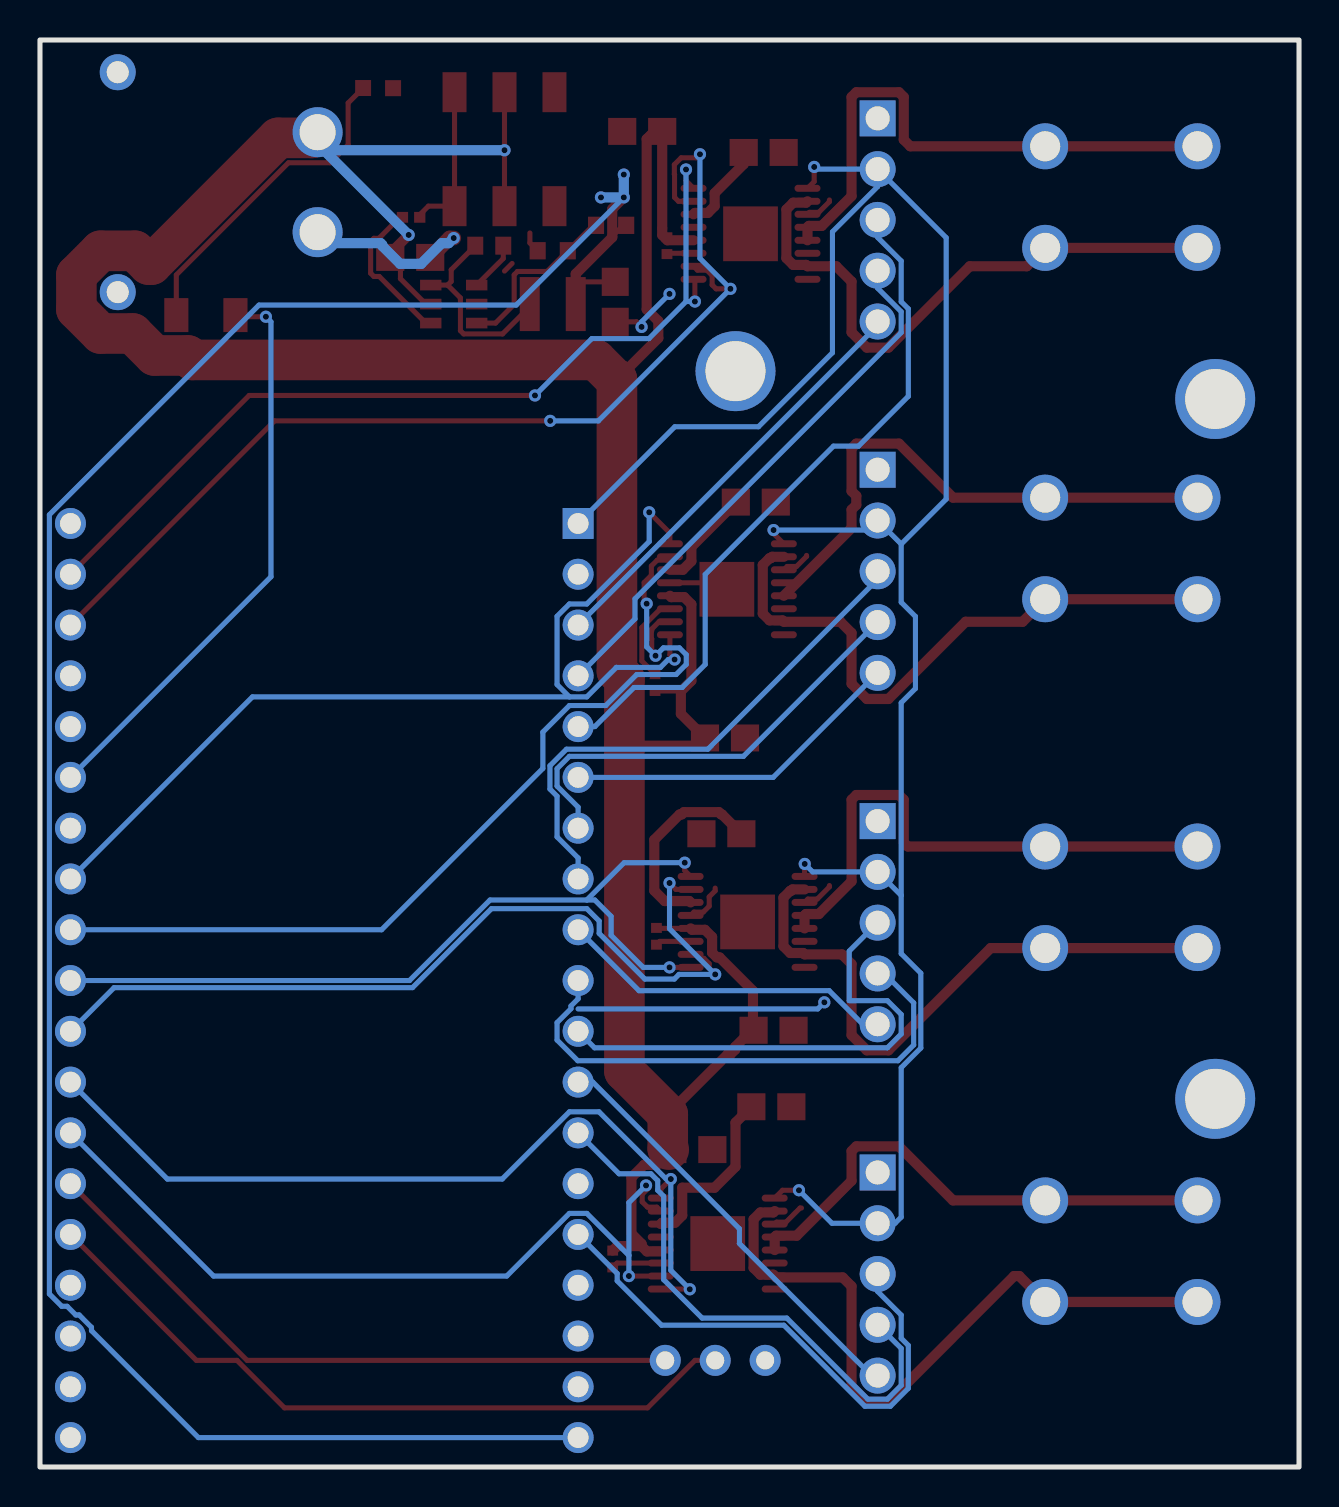
[diagram p9: board, bottom side, seen from below]

Outline 62.99 x 71.37 mm; copper layers: Top Layer, Bottom Layer. Coordinates in mm from the lower left corner of the outline.
Outline path: rectangle 0,71.37 62.99,0
Stack: Top Layer 0.035mm / Dielectric1 1.51mm FR4 er 4.5 / Bottom Layer 0.035mm

## Design rules (mm)
template: JLCPCB Capability(Two Layers Board)
spacing copperThickness1oz (default): track to track 0.102, other pairs 0.152 to 0.3
spacing copperThickness2oz: track to track 0.203, other pairs 0.152 to 0.3
track width copperThickness1oz (default): min 0.127, default 0.254, max 2.54
track width copperThickness2oz: min 0.203, default 0.254, max 2.54
differential pair differentialPair (default): width min 0.127, default 0.254, max 2.54; gap min 0.152, default 0.152
via viaSize (default): diameter min 0.5, default 0.61, max 10; hole min 0.3, default 0.305, max 6.3

## Placement (name value [footprint] x y rotation side)
C1  22nF  [C0603]  40.51 61.09 180 top
C2  22uF  [C0805]  34.21 58.28 270 top
C3  22uF  [C0805]  44.47 60.5 0 top
C5  22uF  [C0805]  26.78 65.75 180 top
C6  100nF  [C0402]  31.62 61.09 90 top
C7  10uF  [C0805]  32.86 66.8 180 top
C12  22uF  [C0805]  27.18 48.26 180 top
C13  100nF  [C0402]  32.22 39.23 270 top
C14  10uF  [C0805]  30.35 15.88 0 top
C15  22uF  [C0805]  28.9 31.67 0 top
C16  100nF  [C0402]  32.15 26.54 90 top
C17  10uF  [C0805]  28.72 36.47 0 top
C18  22uF  [C0805]  26.4 18.02 180 top
C19  100nF  [C0402]  34.34 10.41 90 top
C20  10uF  [C0805]  26.29 21.84 0 top
CN1  B5B-XH-A(LF)(SN)  [CONN-TH_B5B-XH-A-LF-SN]  21.08 62.37 90 top
CN2  B5B-XH-A(LF)(SN)  [CONN-TH_B5B-XH-A-LF-SN]  21.08 44.8 90 top
CN3  B5B-XH-A(LF)(SN)  [CONN-TH_B5B-XH-A-LF-SN]  21.08 27.23 90 top
CN4  B5B-XH-A(LF)(SN)  [CONN-TH_B5B-XH-A-LF-SN]  21.08 9.65 90 top
CN5  DB142R-5.08-2P-GN  [CONN-TH_2P-P5.08_DIBO_DB142R-5.08-2P]  8.89 63.52 270 top
CN6  DB142R-5.08-2P-GN  [CONN-TH_2P-P5.08_DIBO_DB142R-5.08-2P]  8.89 45.94 270 top
CN7  DB142R-5.08-2P-GN  [CONN-TH_2P-P5.08_DIBO_DB142R-5.08-2P]  8.89 28.5 270 top
CN8  DB142R-5.08-2P-GN  [CONN-TH_2P-P5.08_DIBO_DB142R-5.08-2P]  8.89 10.8 270 top
CN9  XT30PW-M30.G.Y  [CONN-TH_XT30PW-M]  54.1 64.26 90 top
L1  4.7uH  [IND-SMD_L3.0-W3.0-1]  37.34 58.17 0 top
MOTOR1  DRV8833PWPR  [TSSOP-16_L5.0-W4.4-P0.65-LS6.4-BL-EP]  27.44 61.68 270 top
MOTOR2  DRV8833PWPR  [TSSOP-16_L5.0-W4.4-P0.65-LS6.4-BL-EP]  28.62 43.9 270 top
MOTOR3  DRV8833PWPR  [TSSOP-16_L5.0-W4.4-P0.65-LS6.4-BL-EP]  27.59 27.26 270 top
MOTOR4  DRV8833PWPR  [TSSOP-16_L5.0-W4.4-P0.65-LS6.4-BL-EP]  29.08 11.18 270 top
NOREF  -  [Pad_e2863]  4.19 18.42 0 top
NOREF#2  -  [Pad_e2901]  28.19 54.81 0 top
NOREF#3  -  [Pad_e3168]  4.19 53.42 0 top
R2  110kΩ  [R0603]  34.42 62.1 180 top
R3  15kΩ  [R0603]  37.34 60.83 180 top
R4  10Ω  [R1206]  54.69 57.61 0 top
R5  100kΩ  [R0402]  44.42 62.5 0 top
Status  GL0603UB01  [LED0603-RD_BLUE]  46.08 68.97 0 top
SW1  MST22D18G2 125  [SW-SMD_MST22D18G2]  39.75 65.91 180 top
U1  ESP32-DEVKITC-32D  [MODULE_ESP32-DEVKITC-32D]  48.77 27.43 0 top
U4  MT2492  [SOT-23-6_L2.9-W1.6-P0.95-LS2.8-BL_3]  42.29 58.17 270 top
UART  B3B-XH-A(LF)(SN)  [CONN-TH_3P-P2.50_A2501WV2-3P]  29.21 5.33 0 top

## Footprints (pads in the part's own frame, mm; a bottom-side part is the same pattern mirrored in y, then rotated)
C0402
  rect 0.5x0.54 smd: 1(-0.42,0) 2(0.42,0)
C0603
  rect 0.8x0.9 smd: 1(-0.7,0) 2(0.7,0)
C0805
  rect 1.41x1.35 smd: 1(-1,0) 2(1,0)
CONN-TH_2P-P5.08_DIBO_DB142R-5.08-2P
  round 2.3 hole 1.5: 1(-2.54,3.81) 1(-2.54,-3.81) 2(2.54,3.81) 2(2.54,-3.81)
CONN-TH_3P-P2.50_A2501WV2-3P
  round 1.55 hole 0.9: 1(-2.5,0) 2(0,0) 3(2.5,0)
CONN-TH_B5B-XH-A-LF-SN
  rect 1.8x1.8 hole 1.2: 1(5.08,0)
  round 1.8 hole 1.2: 2(2.54,0) 3(0,0) 4(-2.54,0) 5(-5.08,0)
CONN-TH_XT30PW-M
  round 2.5 hole 1.8: 1(-2.5,5) 2(2.5,5)
  round 1.8 hole 1.1: 3(5.5,-5) 4(-5.5,-5)
IND-SMD_L3.0-W3.0-1
  rect 1x2.7 smd: 1(-1.15,0) 2(1.15,0)
LED0603-RD_BLUE
  rect 0.8x0.8 smd: 1(-0.749,-0.004) 2(0.749,0.004)
MODULE_ESP32-DEVKITC-32D
  rect 1.548x1.548 hole 1.04: J2-1(-12.7,19.76)
  round 1.548 hole 1.04: J2-2(-12.7,17.22) J2-3(-12.7,14.68) J2-4(-12.7,12.14) J2-5(-12.7,9.6) J2-6(-12.7,7.06) J2-7(-12.7,4.52) J2-8(-12.7,1.98) J2-9(-12.7,-0.56) J2-10(-12.7,-3.1) J2-11(-12.7,-5.64) J2-12(-12.7,-8.18) J2-13(-12.7,-10.72) J2-14(-12.7,-13.26) J2-15(-12.7,-15.8) J2-16(-12.7,-18.34) J2-17(-12.7,-20.88) J2-18(-12.7,-23.42) J2-19(-12.7,-25.96) J3-1(12.7,19.76) J3-2(12.7,17.22) J3-3(12.7,14.68) J3-4(12.7,12.14) J3-5(12.7,9.6) J3-6(12.7,7.06) J3-7(12.7,4.52) J3-8(12.7,1.98) J3-9(12.7,-0.56) J3-10(12.7,-3.1) J3-11(12.7,-5.64) J3-12(12.7,-8.18) J3-13(12.7,-10.72) J3-14(12.7,-13.26) J3-15(12.7,-15.8) J3-16(12.7,-18.34) J3-17(12.7,-20.88) J3-18(12.7,-23.42) J3-19(12.7,-25.96)
Pad_e2863
  round 4 hole 3: 1(0,0)
Pad_e2901
  round 4 hole 3: 1(0,0)
Pad_e3168
  round 4 hole 3: 1(0,0)
R0402
  rect 0.566x0.54 smd: 1(-0.433,0) 2(0.433,0)
R0603
  rect 0.806x0.864 smd: 1(-0.753,0) 2(0.753,0)
R1206
  rect 1.208x1.701 smd: 1(-1.479,0) 2(1.479,0)
SOT-23-6_L2.9-W1.6-P0.95-LS2.8-BL_3
  rect 0.532x1.072 smd: 1(-0.95,-1.149) 2(0,-1.149) 3(0.95,-1.149) 4(0.95,1.149) 5(0,1.149) 6(-0.95,1.149)
SW-SMD_MST22D18G2
  rect 1.2x2 smd: 1(-2.5,2.85) 2(0,2.85) 3(2.5,2.85) 4(-2.5,-2.85) 5(0,-2.85) 6(2.5,-2.85)
TSSOP-16_L5.0-W4.4-P0.65-LS6.4-BL-EP
  oval 0.35x1.3 smd: 1(-2.275,-2.85) 2(-1.625,-2.85) 3(-0.975,-2.85) 4(-0.325,-2.85) 5(0.325,-2.85) 6(0.975,-2.85) 7(1.625,-2.85) 8(2.275,-2.85) 9(2.275,2.85) 10(1.625,2.85) 11(0.975,2.85) 12(0.325,2.85) 13(-0.325,2.85) 14(-0.975,2.85) 15(-1.625,2.85) 16(-2.275,2.85)
  rect 2.74x2.74 smd: 17(0,0)

## Nets
12V: C3.2 C6.2 C7.2 C13.2 C14.2 C16.2 C17.2 C19.2 C20.2 CN9.2 MOTOR1.12 MOTOR2.12 MOTOR3.12 MOTOR4.12 SW1.2 SW1.5 U4.5
+5V: C2.1 L1.1 R2.2 U1.J2-19
GND: C2.2 C3.1 C5.2 C7.1 C12.2 C14.1 C15.2 C17.1 C18.2 C20.1 CN1.1 CN2.1 CN3.1 CN4.1 CN9.1 MOTOR1.3 MOTOR1.6 MOTOR1.13 MOTOR1.17 MOTOR2.3 MOTOR2.6 MOTOR2.13 MOTOR2.17 MOTOR3.3 MOTOR3.6 MOTOR3.13 MOTOR3.17 MOTOR4.3 MOTOR4.6 MOTOR4.13 MOTOR4.17 NOREF.1 NOREF#2.1 NOREF#3.1 R3.1 Status.1 U1.J2-14 U1.J3-1 U1.J3-7 U4.2 UART.1
VCC: CN1.2 CN2.2 CN3.2 CN4.2 MOTOR1.1 MOTOR2.1 MOTOR3.1 MOTOR4.1 U1.J2-1
$1I7589\$1N433: C5.1 MOTOR1.14
$1I7589\$1N443: C6.1 MOTOR1.11
$1I7589\$1N451: CN5.2 MOTOR1.2 MOTOR1.7
$1I7589\$1N910: CN5.1 MOTOR1.4 MOTOR1.5
$1I7941\$1N433: C12.1 MOTOR2.14
$1I7941\$1N443: C13.1 MOTOR2.11
$1I7941\$1N451: CN6.2 MOTOR2.2 MOTOR2.7
$1I7941\$1N910: CN6.1 MOTOR2.4 MOTOR2.5
$1I8037\$1N433: C15.1 MOTOR3.14
$1I8037\$1N443: C16.1 MOTOR3.11
$1I8037\$1N451: CN7.2 MOTOR3.2 MOTOR3.7
$1I8037\$1N910: CN7.1 MOTOR3.4 MOTOR3.5
$1I8133\$1N433: C18.1 MOTOR4.14
$1I8133\$1N443: C19.1 MOTOR4.11
$1I8133\$1N451: CN8.2 MOTOR4.2 MOTOR4.7
$1I8133\$1N910: CN8.1 MOTOR4.4 MOTOR4.5
A1: CN1.4 U1.J2-4
A2: CN2.4 U1.J2-7
A3: CN3.4 U1.J2-10
A4: CN4.4 U1.J2-13
ANALOG1: CN1.5 U1.J2-3
ANALOG2: CN2.5 U1.J2-6
ANALOG3: CN3.5 U1.J2-9
ANALOG4: CN4.5 U1.J2-12
B1: CN1.3 U1.J2-5
B2: CN2.3 U1.J2-8
B3: CN3.3 U1.J2-11
B4: CN4.3 U1.J2-15
PWM1-1: MOTOR1.9 MOTOR1.16 U1.J3-2
PWM1-2: MOTOR2.9 MOTOR2.16 U1.J3-8
PWM1-3: MOTOR3.9 MOTOR3.16 U1.J3-10
PWM1-4: MOTOR4.9 MOTOR4.16 U1.J3-12
PWM2-1: MOTOR1.10 MOTOR1.15 U1.J3-3
PWM2-2: MOTOR2.10 MOTOR2.15 U1.J3-9
PWM2-3: MOTOR3.10 MOTOR3.15 U1.J3-11
PWM2-4: MOTOR4.10 MOTOR4.15 U1.J3-13
RX: U1.J3-15 UART.2
TX: U1.J3-14 UART.3
$1N1716: C1.2 U4.1
$1N1826: R2.1 R3.2 U4.3
$1N2230: C1.1 L1.2 U4.6
$1N8555: R4.1 U1.J3-6
$1N8557: R4.2 Status.2
$1N12055: R5.1 SW1.1 SW1.4
$1N12057: R5.2 U4.4

Pads without a net: CN9 3 4; MOTOR1 8; MOTOR2 8; MOTOR3 8; MOTOR4 8; SW1 3 6; U1 J2-2 J2-16 J2-17 J2-18 J3-4 J3-5 J3-16 J3-17 J3-18 J3-19

## Via types
v1: diameter 0.61, hole 0.305, Top Layer to Bottom Layer, 32 vias

## Routing (per net, layer and track width the routed paths; a pad name or vN(x,y) marks a point on that pad's centre or on a via; arc(x,y) is an arc through that point)
12V: length 171
  Top Layer w0.254: MOTOR3.12 32.12,26.94 C16.2 ; C3.2 44.96,59.99 44.96,59.44 43.69,58.17 U4.5 ; SW1.5 v1(39.75,65.86) SW1.2 ; 30.93,38.8 30.94,38.81 C13.2 ; 31.75,61.85 31.86,61.96
  Top Layer w0.508: 34.16,54.36 32.05,56.46 32.05,57.32 32.64,57.9 32.64,66.42 32.26,66.8 C7.2 ; 31.86,66.24 31.86,61.62 31.6,61.36 MOTOR1.12 ; 31.93,10.78 32.63,10.78 32.89,11.05 ; v1(44.55,61.62) 45.47,60.7 C3.2 ; 33.75,36.08 30.1,36.08 C17.2 30.93,37.67 30.93,38.8 30.4,39.32 30.4,43.15 30.76,43.51 31.41,43.51 MOTOR2.12 ; 32.89,11.05 32.89,11.16 33.4,11.67 33.4,14.48 32.77,15.11 32.13,15.11 31.37,15.88 ; 32.89,11.05 34.11,11.05 C19.2 ; 31.58,17.64 28.59,20.64 28.45,20.64 28.21,20.87 28.21,21.02 27.51,21.72 27.32,21.72 27.32,23.82 28.99,25.49 29.13,25.49 29.36,25.73 29.36,26.51 29.72,26.87 30.37,26.87 MOTOR3.12
  Top Layer w2.032: CN9.2 49.39,66.48 51.08,66.48 57.42,60.14 57.56,60.14 58.25,60.83 59.96,60.83 61.17,59.62 61.17,57.91 59.96,56.69 58.36,56.69 57.26,55.59 55.59,55.59 55.37,55.37 35.18,55.37 34.2,54.39 34.13,54.39 34.13,39.8 33.75,39.43 33.75,19.81 31.58,17.64 31.58,15.93 31.53,15.88
  Bottom Layer w0.508: v1(39.75,65.86) 48.2,65.86 CN9.2 49.1,66.18 v1(44.55,61.62)
+5V: length 114.6
  Top Layer w0.254: 35.71,59.28 34.72,59.28 ; 34.36,61.56 33.81,62.1 33.4,62.1
  Top Layer w0.508: L1.1 36.19,59.68 34.36,61.5 34.36,62.92 v1(33.78,63.5)
  Bottom Layer w0.254: U1.J2-19 55.07,1.47 60.42,6.82 60.42,6.99 61.03,7.61 61.2,7.61 61.63,8.04 61.9,8.04 62.52,8.66 62.52,47.63 52.03,58.12 39.17,58.12 v1(33.78,63.5)
  Bottom Layer w0.508: v1(33.78,64.64) v1(33.78,63.5) v1(34.92,63.5)
GND: length 38.2
  Top Layer w0.254: 23.49,63.37 23.49,63.29 24.03,62.75 24.49,62.75 MOTOR1.3 ; 23.49,29.08 23.49,29.02 24.11,28.41 24.57,28.41 MOTOR3.3 ; 38.48,61.72 38.48,61.22 R3.1 ; 29.21,28.96 29.21,28.82 29.51,28.52 29.51,28.05 29.8,27.76 30.27,27.76 MOTOR3.13 ; 39.37,60.2 39.75,59.82 ; 24.89,12.95 24.96,12.95 25.67,12.25 26.14,12.25 MOTOR4.3 ; v1(32.89,57.02) 33.15,57.28 C2.2 ; MOTOR2.13 29.3,44.23 29.12,44.4 ; MOTOR2.3 25.61,45.04 25.14,45.04 24.64,45.55 24.64,45.59
  Top Layer w0.737: v1(42.29,61.47) 42.5,61.47 C3.1
  Bottom Layer w0.254: v1(32.89,57.02) 32.89,57.28 v1(31.5,58.67) ; 36.07,22.91 24.08,22.91 v1(23.75,23.24)
  Bottom Layer w0.508: CN9.1 49.1,61.64 48.68,61.21 45.95,61.21 45.87,61.13 45.87,61.08 44.97,60.18 43.92,60.18 42.89,61.21 42.55,61.21 v1(42.29,61.47)
VCC: length 108.4
  Top Layer w0.254: MOTOR4.1 25.84,13.84 v1(25.02,13.84) ; 24.59,63.96 24.26,64.29 v1(24.26,65.02) ; v1(24.73,30.16) 24.74,30.15 MOTOR3.1 ; MOTOR2.1 26.29,46.69 v1(26.29,46.86)
  Bottom Layer w0.254: CN1.2 24.15,64.91 v1(24.26,65.02) ; CN1.2 21.08,64.04 23.34,61.78 23.34,55.73 27.04,52.03 31.23,52.03 36.07,47.19 ; CN1.2 17.65,61.49 17.65,48.41 19.9,46.16 ; 19.9,46.16 21.08,47.34 21.56,46.86 v1(26.29,46.86) ; 19.9,46.16 19.9,43.25 19.19,42.54 19.19,38.94 19.9,38.22 19.9,28.59 ; 19.9,28.59 CN3.2 24.33,29.77 v1(24.73,30.16) ; 19.9,28.59 19.9,25.68 18.92,24.7 18.92,20.96 19.9,19.98 19.9,12.5 20.21,12.19 23.37,12.19 v1(25.02,13.84)
$1I7589\$1N433: length 4.5
  Top Layer w0.508: C5.1 27.78,65.16 29.24,63.71 29.24,63.07 29.58,62.73 30.22,62.73 MOTOR1.14
$1I7589\$1N443: length 1.4
  Top Layer w0.254: MOTOR1.11 31.66,60.71 C6.1
$1I7589\$1N451: length 29.6
  Top Layer w0.508: CN5.2 CN5.2 13.62,60.06 16.47,60.06 20.54,55.99 21.62,55.99 22.39,56.75 22.39,59.29 23.15,60.06 MOTOR1.7 24.66,60.13 25.31,60.13 25.65,60.47 25.65,62.9 25.31,63.24 24.66,63.24 MOTOR1.2
$1I7589\$1N910: length 28.2
  Top Layer w0.508: CN5.1 CN5.1 19.45,66.06 19.78,66.39 19.78,68.52 20.01,68.76 22.15,68.76 22.39,68.52 22.39,63.56 23.88,62.08 24.52,62.08 MOTOR1.4 MOTOR1.5
$1I7941\$1N433: length 5.1
  Top Layer w0.508: MOTOR2.14 30.83,44.88 30.4,45.3 30.4,46.02 28.18,48.25 C12.1
$1I7941\$1N443: length 4.4
  Top Layer w0.254: MOTOR2.11 31.94,42.93 32.88,41.99 32.88,40.32 C13.1
$1I7941\$1N451: length 30.7
  Top Layer w0.508: CN6.2 CN6.2 13.83,42.28 16.68,42.28 20.54,38.41 21.62,38.41 22.39,39.18 22.39,41.72 22.95,42.28 MOTOR2.7 25.84,42.35 26.49,42.35 26.83,42.69 26.83,45.12 26.49,45.46 26.42,45.46 26.36,45.53 MOTOR2.2
$1I7941\$1N910: length 27.5
  Top Layer w0.508: MOTOR2.5 22.39,46.96 22.39,47.88 22.15,48.12 22.15,48.57 22.39,48.81 22.39,50.95 22.15,51.19 20.01,51.19 17.31,48.48 CN6.1 CN6.1
$1I8037\$1N433: length 10
  Top Layer w0.508: C15.1 28.86,32.64 28.91,32.64 29.03,32.76 30.77,32.76 30.89,32.64 30.99,32.64 32.26,31.37 32.26,28.83 31.74,28.31 30.51,28.31 MOTOR3.14
$1I8037\$1N443: length 1.8
  Top Layer w0.254: C16.1 31.98,26.29 MOTOR3.11
$1I8037\$1N451: length 30.7
  Top Layer w0.508: CN7.2 CN7.2 15.42,25.96 20.54,20.84 21.62,20.84 22.39,21.61 22.39,25.16 22.87,25.64 MOTOR3.7 24.81,25.71 25.45,25.71 25.8,26.05 25.8,28.48 25.45,28.82 25.41,28.82 25.34,28.89 MOTOR3.2
$1I8037\$1N910: length 27.5
  Top Layer w0.508: CN7.1 CN7.1 19.57,31.04 19.78,31.24 19.78,33.37 20.01,33.61 22.15,33.61 22.39,33.37 22.39,29.29 24.02,27.66 24.67,27.66 MOTOR3.4 MOTOR3.5
$1I8133\$1N433: length 9.1
  Top Layer w0.508: MOTOR4.14 31.86,12.22 31.22,12.22 30.86,12.58 30.86,13.97 29.24,13.97 28.19,15.02 28.19,17.22 C18.1
$1I8133\$1N443: length 2.5
  Top Layer w0.254: MOTOR4.11 34.12,10.2 C19.1
$1I8133\$1N451: length 34.7
  Top Layer w0.508: MOTOR4.2 26.3,12.73 26.95,12.73 27.29,12.39 27.29,9.96 26.95,9.62 26.3,9.62 MOTOR4.7 26.16,9.48 22.83,9.48 22.39,9.04 22.39,4.03 21.62,3.27 20.54,3.27 14.26,9.55 14,9.55 CN8.2 CN8.2
$1I8133\$1N910: length 25.7
  Top Layer w0.508: CN8.1 CN8.1 17.31,13.34 20.01,16.04 22.15,16.04 22.39,15.8 22.39,14.32 25.13,11.57 26.16,11.57 MOTOR4.4 MOTOR4.5
A1: length 27.4
  Bottom Layer w0.254: CN1.4 21.08,58.96 19.9,57.78 19.9,56.74 33.22,43.42 33.22,42.42 36.07,39.57
A2: length 22.5
  Bottom Layer w0.254: CN2.4 27.8,35.55 36.5,35.55 37.12,34.93 37.12,34.06 36.07,33 U1.J2-7
A3: length 26.5
  Bottom Layer w0.254: 36.07,24.33 36.07,23.42 36.42,23.06 36.42,22.93 37.12,22.23 37.12,21.36 36.08,20.32 20.07,20.32 19.28,21.11 19.28,23.22 20.75,24.69 CN3.4
A4: length 28.2
  Bottom Layer w0.254: 36.07,16.71 34.02,14.67 32.43,14.67 32.09,14.33 32.09,13.84 31.79,13.54 31.79,9.37 29.86,7.45 25.63,7.45 21.57,3.39 20.59,3.39 19.9,4.08 19.9,5.93 CN4.4
ANALOG1: length 21.4
  Bottom Layer w0.254: 36.07,42.11 21.08,57.1 CN1.5
ANALOG2: length 17.2
  Bottom Layer w0.254: CN2.5 26.31,34.49 36.07,34.49
ANALOG3: length 16.9
  Bottom Layer w0.254: U1.J2-9 33.02,23.83 23.51,23.83 21.83,22.15 CN3.5
ANALOG4: length 21.5
  Bottom Layer w0.254: U1.J2-12 35.33,19.25 28,11.92 28,11.18 21.39,4.57 CN4.5
B1: length 35.5
  Bottom Layer w0.254: CN1.3 21.08,61.5 19.9,60.32 19.9,58.29 19.55,57.93 19.55,53.55 22.04,51.06 23.29,51.06 29.71,44.64 29.71,40.14 30.86,38.99 33.27,38.99 35.23,37.03 U1.J2-5
B2: length 26.9
  Bottom Layer w0.254: CN2.3 21.08,44.4 29.58,35.9 36.65,35.9 37.48,35.08 37.48,33.91 37.12,33.55 37.12,31.52 36.07,30.46 36.07,29.41
B3: length 25.1
  Bottom Layer w0.254: U1.J2-11 35.24,20.97 20.59,20.97 19.9,21.66 19.9,22.63 20.59,23.33 22.5,23.33 22.5,25.8 CN3.3
B4: length 27
  Bottom Layer w0.254: CN4.3 21.08,8.78 19.9,7.6 19.9,6.44 19.55,6.08 19.55,3.94 20.45,3.04 21.72,3.04 25.77,7.09 31.89,7.09 34.11,9.31 34.11,9.68 U1.J2-15
PWM1-1: length 45.7
  Top Layer w0.254: MOTOR1.9 30.23,59.34 v1(30.23,58.29) ; 30.29,63.96 30.67,64.33 v1(30.67,64.9) ; 61.47,44.65 52.53,53.59 v1(38.23,53.59)
  Bottom Layer w0.254: v1(38.23,53.59) 35.38,56.44 32.52,56.44 30.67,58.29 ; 30.67,58.29 v1(30.23,58.29) ; 30.67,58.29 v1(30.67,64.9)
PWM1-2: length 50
  Top Layer w0.254: v1(32.51,47.75) 31.48,46.72 MOTOR2.16 ; v1(31.24,40.39) 31.48,40.62 MOTOR2.9
  Bottom Layer w0.254: 61.47,29.41 52.36,38.52 36.5,38.52 ; v1(31.24,40.39) 31.56,40.39 31.95,39.99 34.16,39.99 35.63,38.52 36.5,38.52 ; 36.5,38.52 37.12,39.14 37.12,42.55 36.5,43.17 35.63,43.17 32.51,46.29 v1(32.51,47.75)
PWM1-3: length 41.1
  Top Layer w0.254: MOTOR3.9 v1(31.5,24.99) ; v1(30.73,30.23) 30.73,29.83 MOTOR3.16
  Bottom Layer w0.254: 35.63,28.36 40.48,28.36 44.5,24.33 61.47,24.33 ; 35.63,28.36 35.23,28.36 34.42,27.54 34.42,26.6 32.81,24.99 v1(31.5,24.99) ; 35.63,28.36 33.77,30.23 v1(30.73,30.23)
PWM1-4: length 43.4
  Top Layer w0.254: MOTOR4.9 30.49,8.9 v1(30.48,8.89) ; v1(31.43,14.4) 31.93,13.9 MOTOR4.16
  Bottom Layer w0.254: v1(30.48,8.89) 31.43,9.84 v1(31.43,14.4) 31.66,14.4 35.02,17.77 36.5,17.77 39.87,14.4 56.62,14.4 61.47,19.25
PWM2-1: length 54.1
  Top Layer w0.254: MOTOR1.15 31.05,63.31 31.24,63.5 31.24,64.64 31.25,64.66 31.25,65.14 30.91,65.48 30.15,65.48 v1(29.97,65.66) ; MOTOR1.10 30.1,59.86 29.63,59.86 29.36,59.59 29.36,59.13 29.16,58.93 v1(28.45,58.93) ; 61.47,42.11 51.26,52.32 v1(37.46,52.32)
  Bottom Layer w0.254: v1(37.46,52.32) 35.05,52.32 v1(28.45,58.93) 29.97,60.45 v1(29.97,65.66)
PWM2-2: length 48.2
  Top Layer w0.254: v1(32.19,40.58) 32.39,40.77 32.39,41.42 32.4,41.44 32.4,41.81 32.39,41.83 32.39,41.91 32.02,42.28 MOTOR2.10 ; v1(32.64,43.18) 32.77,43.31 32.77,44.24 32.4,44.6 32.4,45.06 32.11,45.36 31.64,45.36 MOTOR2.15
  Bottom Layer w0.254: 61.47,26.87 45.9,26.87 37.83,34.94 37.83,36.76 36.5,38.09 34.69,38.09 33.13,39.64 31.17,39.64 30.66,40.14 30.66,40.63 31,40.97 31.8,40.97 v1(32.19,40.58) 32.64,41.02 v1(32.64,43.18)
PWM2-3: length 45.2
  Top Layer w0.254: v1(29.21,24.64) 29.51,24.94 29.51,25.18 29.78,25.44 30.02,25.44 30.21,25.64 MOTOR3.10 ; v1(31.5,29.21) 31.17,28.89 MOTOR3.15
  Bottom Layer w0.254: v1(31.5,29.21) 31.5,26.92 v1(29.21,24.64) 31.02,24.64 31.25,24.41 32.73,24.41 35.02,26.69 35.02,27.31 35.63,27.93 40.41,27.93 44.35,23.98 59.28,23.98 61.47,21.79
PWM2-4: length 41.7
  Top Layer w0.254: MOTOR4.10 v1(33.53,9.55) ; MOTOR4.15 32.13,13 32.6,13 32.86,13.26 32.86,13.64 32.6,13.91 32.58,13.91 32.67,14 v1(32.67,14.08)
  Bottom Layer w0.254: 33.53,10.58 35.63,12.69 36.5,12.69 39.64,9.55 54.31,9.55 61.47,16.71 ; 33.53,10.58 v1(33.53,9.55) ; 33.53,10.58 33.53,13.23 v1(32.67,14.08)
RX: length 36.8
  Top Layer w0.254: 61.47,11.63 55.17,5.33 53.13,5.33 50.76,2.96 32.59,2.96 30.22,5.33 UART.2
TX: length 33.4
  Top Layer w0.254: UART.3 52.63,5.33 61.47,14.17
$1N1716: length 2.5
  Top Layer w0.254: C1.2 39.81,60.45 U4.1
$1N1826: length 9
  Top Layer w0.254: U4.3 40.2,57.22 39.27,58.15 39.27,59.63 39.1,59.8 37.62,59.8 R3.2 35.31,62.1 35.04,62.1
$1N2230: length 10.1
  Top Layer w0.254: 42.6,59.12 U4.6 ; 42.6,59.12 41.96,58.48 41.96,56.83 41.79,56.67 39.85,56.67 38.61,57.91 38.61,58.17 ; 42.6,59.12 42.42,59.3 42.42,59.88 C1.1
$1N8555: length 28.9
  Top Layer w0.254: v1(51.69,57.53) 53.13,57.53 R4.1
  Bottom Layer w0.254: 61.47,34.49 51.43,44.53 51.43,57.28 v1(51.69,57.53)
$1N8557: length 16.5
  Top Layer w0.254: R4.2 56.17,59.63 50.56,65.23 48.47,65.23 47.57,66.13 47.57,68.22 Status.2
$1N12055: length 7.6
  Top Layer w0.254: 43.99,62.63 43.56,63.06 SW1.1 SW1.4
$1N12057: length 7.8
  Top Layer w0.254: 44.86,62.63 46.03,61.45 46.29,61.45 46.45,61.29 46.45,59.71 46.29,59.55 46.02,59.55 43.69,57.22 U4.4

## Copper pours and planes (outline as drawn; the poured copper is in the pictures)
GND on Top Layer: 0.13,71.25 62.86,71.25 62.86,0.13 0.13,0.13
